# Altium project PCB_DATN.PrjPcb
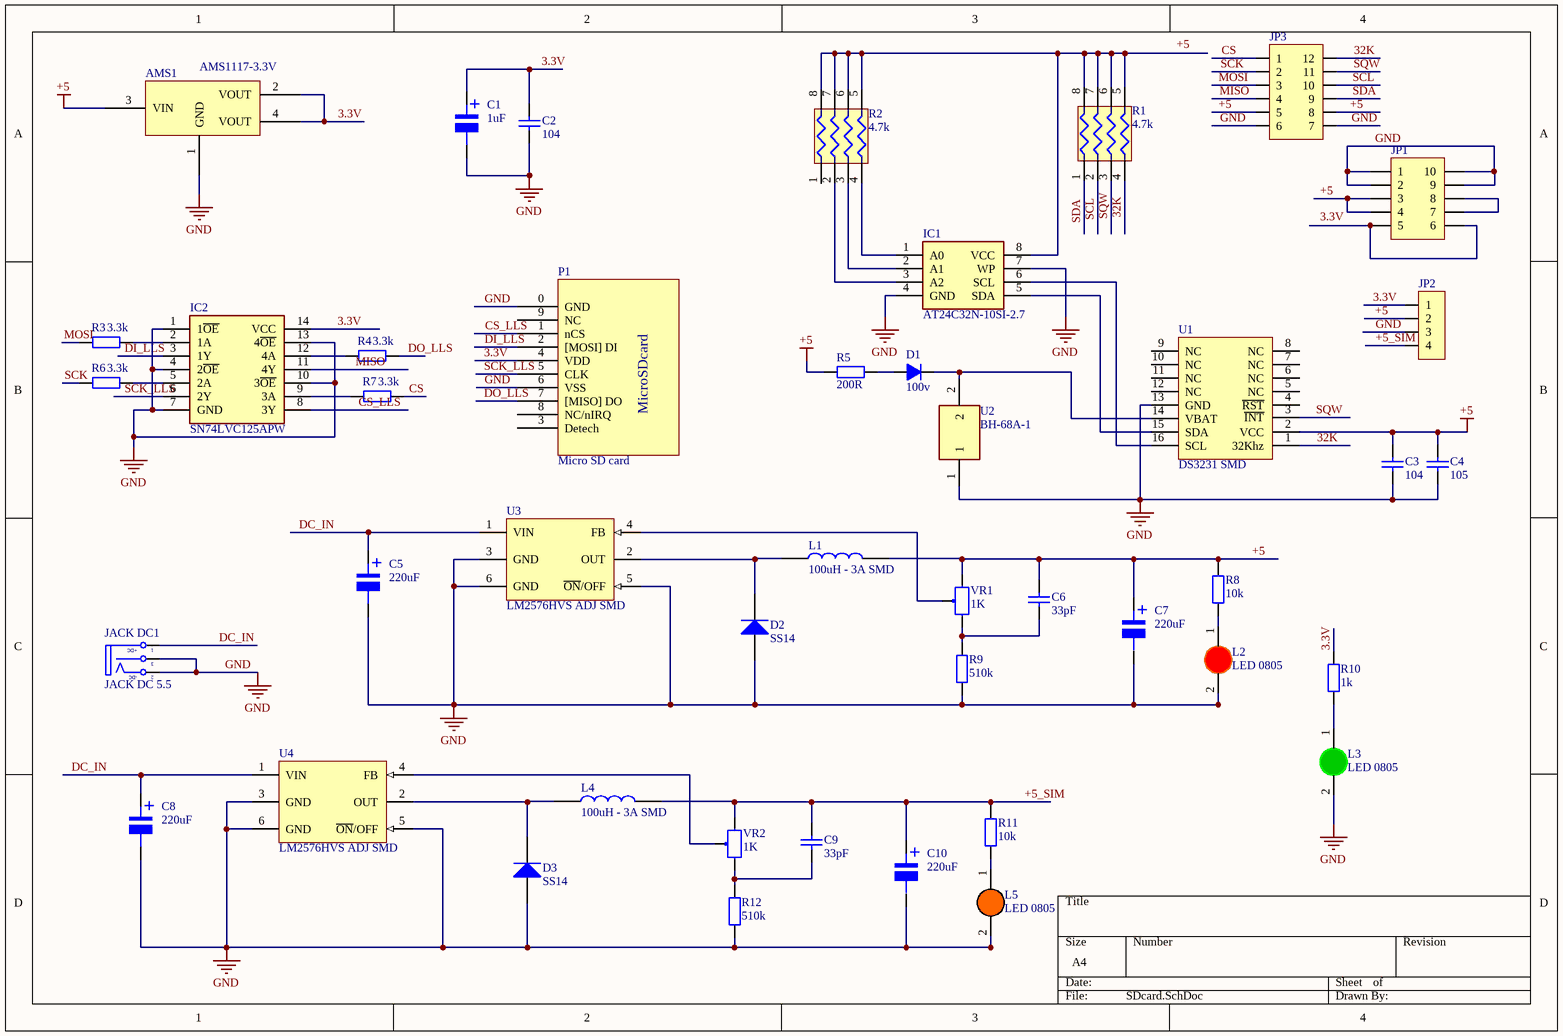
[diagram p0: SDcard.SchDoc]
1 sheet, 44 parts. Net scope: global (net labels, ports and power ports of the same name join across sheets).
Board file: SDcard.PcbDoc

## Sheet SDcard.SchDoc
size A4; SheetNumber: 1; SheetTotal: 1

### Parts
AMS1  AMS1117-3.3V  [SOT223]
C1  1uF  [tu nhom 4 (B)]
C2  104  [tu 0805]
C3  104  [tu 1206]
C4  105  [tu 0805]
C5  220uF  [tu nhom 6.3 (d)]
C6  33pF  [tu 0805]
C7  220uF  [tu nhom 6.3 (d)]
C8  220uF  [tu nhom 6.3 (d)]
C9  33pF  [tu 0805]
C10  220uF  [tu nhom 6.3 (d)]
D1  100v  [DIODE 0.5A]
D2  SS14  [DIODE SMA]
D3  SS14  [DIODE SMA]
IC1  AT24C32N-10SI-2.7  [SOIC127P620X175-8N]
IC2  SN74LVC125APW  [SOP65P640X120-14N]
JACK_DC1  JACK DC 5.5  [JACK DC 5.5]
JP1  JP 2x5 2.54  [JP 2x5 DT]  (value not drawn)
JP2  JP 1x4 2.54  [JP 1x4 DT]  (value not drawn)
JP3  JP 2x6 2.54  [JP 2x6 DT]  (value not drawn)
L1  100uH - 3A SMD  [Cuon Cam 12x12x10]
L2  LED 0805  [LED-0805-Red]
L3  LED 0805  [LED-0805-Green]
L4  100uH - 3A SMD  [Cuon Cam 12x12x10]
L5  LED 0805  [LED-0805-Orange]
P1  Micro SD card  [MicroSD]
R1  4.7k  [tro bang 0603 4]
R2  4.7k  [tro bang 0603 4]
R3  3.3k  [tro smd 0805]
R4  3.3k  [tro smd 0805]
R5  200R  [tro smd 0805]
R6  3.3k  [tro smd 0805]
R7  3.3k  [tro smd 0805]
R8  10k  [tro smd 0805]
R9  510k  [tro smd 0805]
R10  1k  [tro smd 0805]
R11  10k  [tro smd 0805]
R12  510k  [tro smd 0805]
U1  DS3231 SMD  [SOIC 16]
U2  BH-68A-1  [BH68A1]
U3  LM2576HVS ADJ SMD  [TO263-5]
U4  LM2576HVS ADJ SMD  [TO263-5]
VR1  1K  [Bien Tro Vi Chinh Dung]
VR2  1K  [Bien Tro Vi Chinh Dung]

### Nets
+5: AMS1.3(VIN) C3.1 C4.1 C6.1 C7.1 JP1.3 JP1.4 JP2.2 JP3.5 JP3.8 L1.2 R5.1 R8.2 U1.2(VCC) VR1.3
GND: AMS1.1(GND) C1.2 C2.1 C3.2 C4.2 C5.2 C7.2 C8.2 C10.2 D2.1(A) D3.1(A) IC1.4(GND) IC1.7(WP) IC2.1(1~{OE}) IC2.4(2~{OE}) IC2.7(GND) IC2.10(3~{OE}) IC2.13(4~{OE}) JACK_DC1.2(TN) JACK_DC1.3(S) JP1.1 JP1.2 JP1.9 JP1.10 JP2.3 JP3.6 JP3.7 L2.2(K) L3.2(K) L5.2(K) P1.0(GND) P1.6(VSS) R9.1 R12.1 U1.13(GND) U2.1 U3.3(GND) U3.5(~{ON}/OFF) U3.6(GND) U4.3(GND) U4.5(~{ON}/OFF) U4.6(GND)
3.3V: AMS1.2(VOUT) AMS1.4(VOUT) C1.1 C2.2 IC2.14(VCC) JP2.1 P1.4(VDD) R10.2
32K: JP3.12 R1.4 U1.1(32Khz)
+5_SIM: C9.1 C10.1 JP2.4 L4.2 R11.2 VR2.3
CS: JP3.1 R7.2
CS_LLS: IC2.8(3Y) P1.1(nCS)
DC_IN: C5.1 C8.1 JACK_DC1.1(T) U3.1(VIN) U4.1(VIN)
DI_LLS: IC2.3(1Y) P1.2([MOSI]_DI)
DO_LLS: P1.7([MISO]_DO) R4.2
MISO: IC2.11(4Y) JP3.4
MOSI: JP3.3 R3.1
SCK: JP3.2 R6.1
SCK_LLS: IC2.6(2Y) P1.5(CLK)
SCL: JP3.10 R1.2
SDA: JP3.9 R1.1
SQW: JP3.11 R1.3 U1.3(~{INT})
NetC6_2: C6.2 R9.2 VR1.1
NetC9_2: C9.2 R12.2 VR2.1
NetD1_1: D1.1(A) R5.2
NetD1_2: D1.2(K) U1.14(VBAT) U2.2
NetD2_2: D2.2(K) L1.1 U3.2(OUT)
NetD3_2: D3.2(K) L4.1 U4.2(OUT)
NetIC1_1: IC1.1(A0) R2.4
NetIC1_2: IC1.2(A1) R2.3
NetIC1_3: IC1.3(A2) R2.2
NetIC1_5: IC1.5(SDA) U1.15(SDA)
NetIC1_6: IC1.6(SCL) U1.16(SCL)
NetIC1_8: IC1.8(VCC) R1.5 R1.6 R1.7 R1.8 R2.5 R2.6 R2.7 R2.8
NetIC2_2: IC2.2(1A) R3.2
NetIC2_5: IC2.5(2A) R6.2
NetIC2_9: IC2.9(3A) R7.1
NetIC2_12: IC2.12(4A) R4.1
NetJP1_5: JP1.5 JP1.6
NetJP1_7: JP1.7 JP1.8
NetL2_1: L2.1(A) R8.1
NetL3_1: L3.1(A) R10.1
NetL5_1: L5.1(A) R11.1
NetU3_4: U3.4(FB) VR1.2
NetU4_4: U4.4(FB) VR2.2

Not connected (* = marked no-connect by the designer): P1 3(Detech) 8(NC/nIRQ) 9(NC); R2 1; U1 4(~{RST}) 5(NC) 6(NC) 7(NC) 8(NC) 9(NC) 10(NC) 11(NC) 12(NC)

### Notes on the sheet
- Labels drawn without touching a wire or pin: 3.3V, +5
- (in symbol JACK DC 5.5) +DC; -DC
- (in symbol Micro SD card) MicroSDcard
- (in symbol Tu Nhom 1uF 50V) +
- (in symbol Tu Nhom 220uF 16V) +

### Library data of the parts
AMS1 = AMS1117 SMD: Dán; Value: AMS1117-3.3V SOT223; Don_Vi: Con; Ma_Hang: MH000596; Ghi_Chu: *; Kieu_Chan: *; Chung_Loai: Dán
C1 = Tu Nhom 1uF 50V: Dán; Don_Vi: Con; So_Chan: 2; Ten_Linh_Kien: Tụ Nhôm 1uF 50V 4x5.4MM; Ma_Hang: MH007467; Chung_Loai: Dán; Kieu_Chan: *
C2 = Tu 0805 104 50V 10%: Dán; Don_Vi: Con; So_Chan: 2; Ten_Linh_Kien: Tụ 0805 104-100nF 10% 50V; Ma_Hang: MH004551; Chung_Loai: Dán; Kieu_Chan: *
C3 = Tu 1206 104 50V 20%: Dán; Don_Vi: Con; So_Chan: 2; Ten_Linh_Kien: Tụ 1206 104-0.1uF 20% 50V; Ma_Hang: MH004544; Chung_Loai: Dán; Kieu_Chan: *
C4 = Tu 0805 105 50V 10%: Dán; Don_Vi: Con; So_Chan: 2; Ten_Linh_Kien: Tụ 0805 105-1uF 10% 50V; Ma_Hang: MH004552; Chung_Loai: Dán; Kieu_Chan: *
C5 C7 C8 C10 = Tu Nhom 220uF 16V: Dán; Don_Vi: Con; So_Chan: 2; Ten_Linh_Kien: Tụ Nhôm 220uF 16V 6.3x7.7MM; Ma_Hang: MH002227; Chung_Loai: Dán; Kieu_Chan: *
C6 C9 = Tu 0805 33pF 50V 10%: Dán; Don_Vi: Con; So_Chan: 2; Ten_Linh_Kien: Tụ 0805 33p 10% 50V; Ma_Hang: MH004563; Chung_Loai: Dán; Kieu_Chan: *
D1 = Diode 1N4148: Cắm; Ten_Linh_Kien: Diode 1N4148 DO35 450mA 100V ( 1N4148 DIP); Don_Vi: Con; Ma_Hang: MH001065; Ghi Chu: *; Kieu_Chan: *; Chung_Loai: Cắm
D2 D3 = Diode SS14 ( 1N5819): Dán; Ma_Hang: MH002211; Don_Vi: Con; Ten_Linh_Kien: Diode SS14 DO214 Schottky 1A 40V ( 1N5819 DO214); Chung_Loai: Dán; Ghi_Chu: *; Kieu_Chan: *
IC1 = AT24C32N-10SI-2.7: Integrated Circuit; Manufacturer_Name: Microchip; Datasheet Link: https://media.digikey.com/pdf/Data%20Sheets/Atmel%20PDFs/AT24C32,64.pdf; Height: 1.75mm; Manufacturer_Part_Number: AT24C32N-10SI-2.7; Mouser Part Number: 556-AT24C32N10SI2.7; Mouser Price/Stock: https://www.mouser.co.uk/ProductDetail/Microchip-Technology/AT24C32N-10SI-27?qs=fKsNvYl5pt8HdLBcCulm1Q%3D%3D
IC2 = SN74LVC125APW: Integrated Circuit; Manufacturer_Name: Texas Instruments; Datasheet Link: http://www.ti.com/lit/ds/symlink/sn74lvc125a.pdf; Height: 1.2mm; Manufacturer_Part_Number: SN74LVC125APW; Mouser Part Number: 595-SN74LVC125APW; Mouser Price/Stock: https://www.mouser.co.uk/ProductDetail/Texas-Instruments/SN74LVC125APW?qs=dT9u2OTAaVWiVMpIt3mBKA%3D%3D; Arrow Part Number: SN74LVC125APW; Arrow Price/Stock: https://www.arrow.com/en/products/sn74lvc125apw/texas-instruments?region=nac
JACK_DC1 = JACK DC 5.5: Value: Jac DC
JP1 = JP 2x5 2.54 Duc Thang: Cắm; Ten_Linh_Kien: Jump Đôi Đực 2.54MM 2x40P Thẳng 11MM; Don_Vi: Con; Ma_Hang: MH002686; Ghi_Chu: *; Kieu_Chan: *; Chung_Loai: Cắm
JP2 = JP 1x4 2.54 Duc Thang: Cắm; Ten_Linh_Kien: Jump Đơn Đực 2.54MM 1x40P Thẳng 11MM; Don_Vi: Con; Ma_Hang: MH000903; Ghi_Chu: *; Kieu_Chan: *; Chung_Loai: Cắm
JP3 = JP 2x6 2.54 Duc Thang: Cắm; Ten_Linh_Kien: Jump Đôi Đực 2.54MM 2x40P Thẳng 11MM; Don_Vi: Con; Ma_Hang: MH002686; Ghi_Chu: *; Kieu_Chan: *; Chung_Loai: Cắm
L1 L4 = CUON CAM 100uH SMD: Dán; Don_Vi: Con; Ma_Hang: MH003999; Ten_Linh_Kien: Cuộn Cảm 100uH 7x7x4MM CD74; Ma_Hang: *; Kieu_Chan: *; Chung_Loai: Dán
L2 = LED 0805 Do: Dán; Don_Vi: Con; Ma_Hang: MH000897; Ten_Linh_Kien: LED 0805 Màu Đỏ (Red); Ghi_Chu: *; Kieu_Chan: *; Chung_Loai: Dán
L3 = LED 0805 Xanh La: Dán; Don_Vi: Con; Ma_Hang: MH002326; Ten_Linh_Kien: LED 0805 Màu Xanh Lá (Green); Ghi_Chu: *; Kieu_Chan: *; Chung_Loai: Dán
L5 = LED 0805 Cam: Dán; Don_Vi: Con; Ma_Hang: MH002328; Ten_Linh_Kien: LED 0805 Màu Cam ( Orange); Ghi_Chu: *; Kieu_Chan: *; Chung_Loai: Dán
R1 R2 = Tro bang 0603 4.7k: Dán; Don_Vi: Con; So_Chan: 8; Ten_Linh_Kien: Trở băng 0603x4 4.7k; Ma_Hang: MH001448; Chung_Loai: Dán; Kieu_Chan: *
R3 R4 R6 R7 = Tro 0805 1% 3.3k: Dán; Don_Vi: Con; So_Chan: 2; Ten_Linh_Kien: Trở 0805 1% 3.3k; Ma_Hang: MH005472; Chung_Loai: Dán; Kieu_Chan: *
R5 = Tro 0805 5% 200R: Dán; Don_Vi: Con; So_Chan: 2; Ten_Linh_Kien: Trở 0805 5% 200R; Ma_Hang: MH005257; Chung_Loai: Dán; Kieu_Chan: *
R8 R11 = Tro 0805 1% 10k: Dán; Don_Vi: Con; So_Chan: 2; Ten_Linh_Kien: Trở 0805 1% 10k; Ma_Hang: MH005473; Chung_Loai: Dán; Kieu_Chan: *
R9 R12 = Tro 0805 1% 510k: Dán; Don_Vi: Con; So_Chan: 2; Ten_Linh_Kien: Trở 0805 1% 510k; Ma_Hang: MH005486; Chung_Loai: Dán; Kieu_Chan: *
R10 = Tro 0805 5% 1k: Dán; Don_Vi: Con; So_Chan: 2; Ten_Linh_Kien: Trở 0805 5% 1k; Ma_Hang: MH005234; Chung_Loai: Dán; Kieu_Chan: *
U1 = DS3231 SMD: SOIC
U2 = BH-68A-1: Undefined or Miscellaneous; Manufacturer_Name: Adam Tech; Datasheet Link: https://datasheet.datasheetarchive.com/originals/distributors/Datasheets_SAMA/70f8d3eb5adb5c6430ba15a257ae11e9.pdf; Height: 9mm; Manufacturer_Part_Number: BH-68A-1
U3 U4 = LM2576HVS ADJ SMD: Dán; Ten_Linh_Kien: LM2576HVS-ADJ BUCK ADJ 3A TO263-5; Don_Vi: Con; Ma_Hang: MH002361; Ghi_Chu: *; Kieu_Chan: *; Chung_Loai: Dán
VR1 VR2 = Bien Tro Tinh Chinh 1K Dung: Cắm; Don_Vi: Con; Ten_Linh_Kien: Biến Trở VR 102-1K 3296W; Ma_Hang: MH003234; Kieu_Chan: *; Chung_Loai: Cắm